# EAGLE design alpha3 (EAGLE 7.6.0)

## Sheet 1 of 5
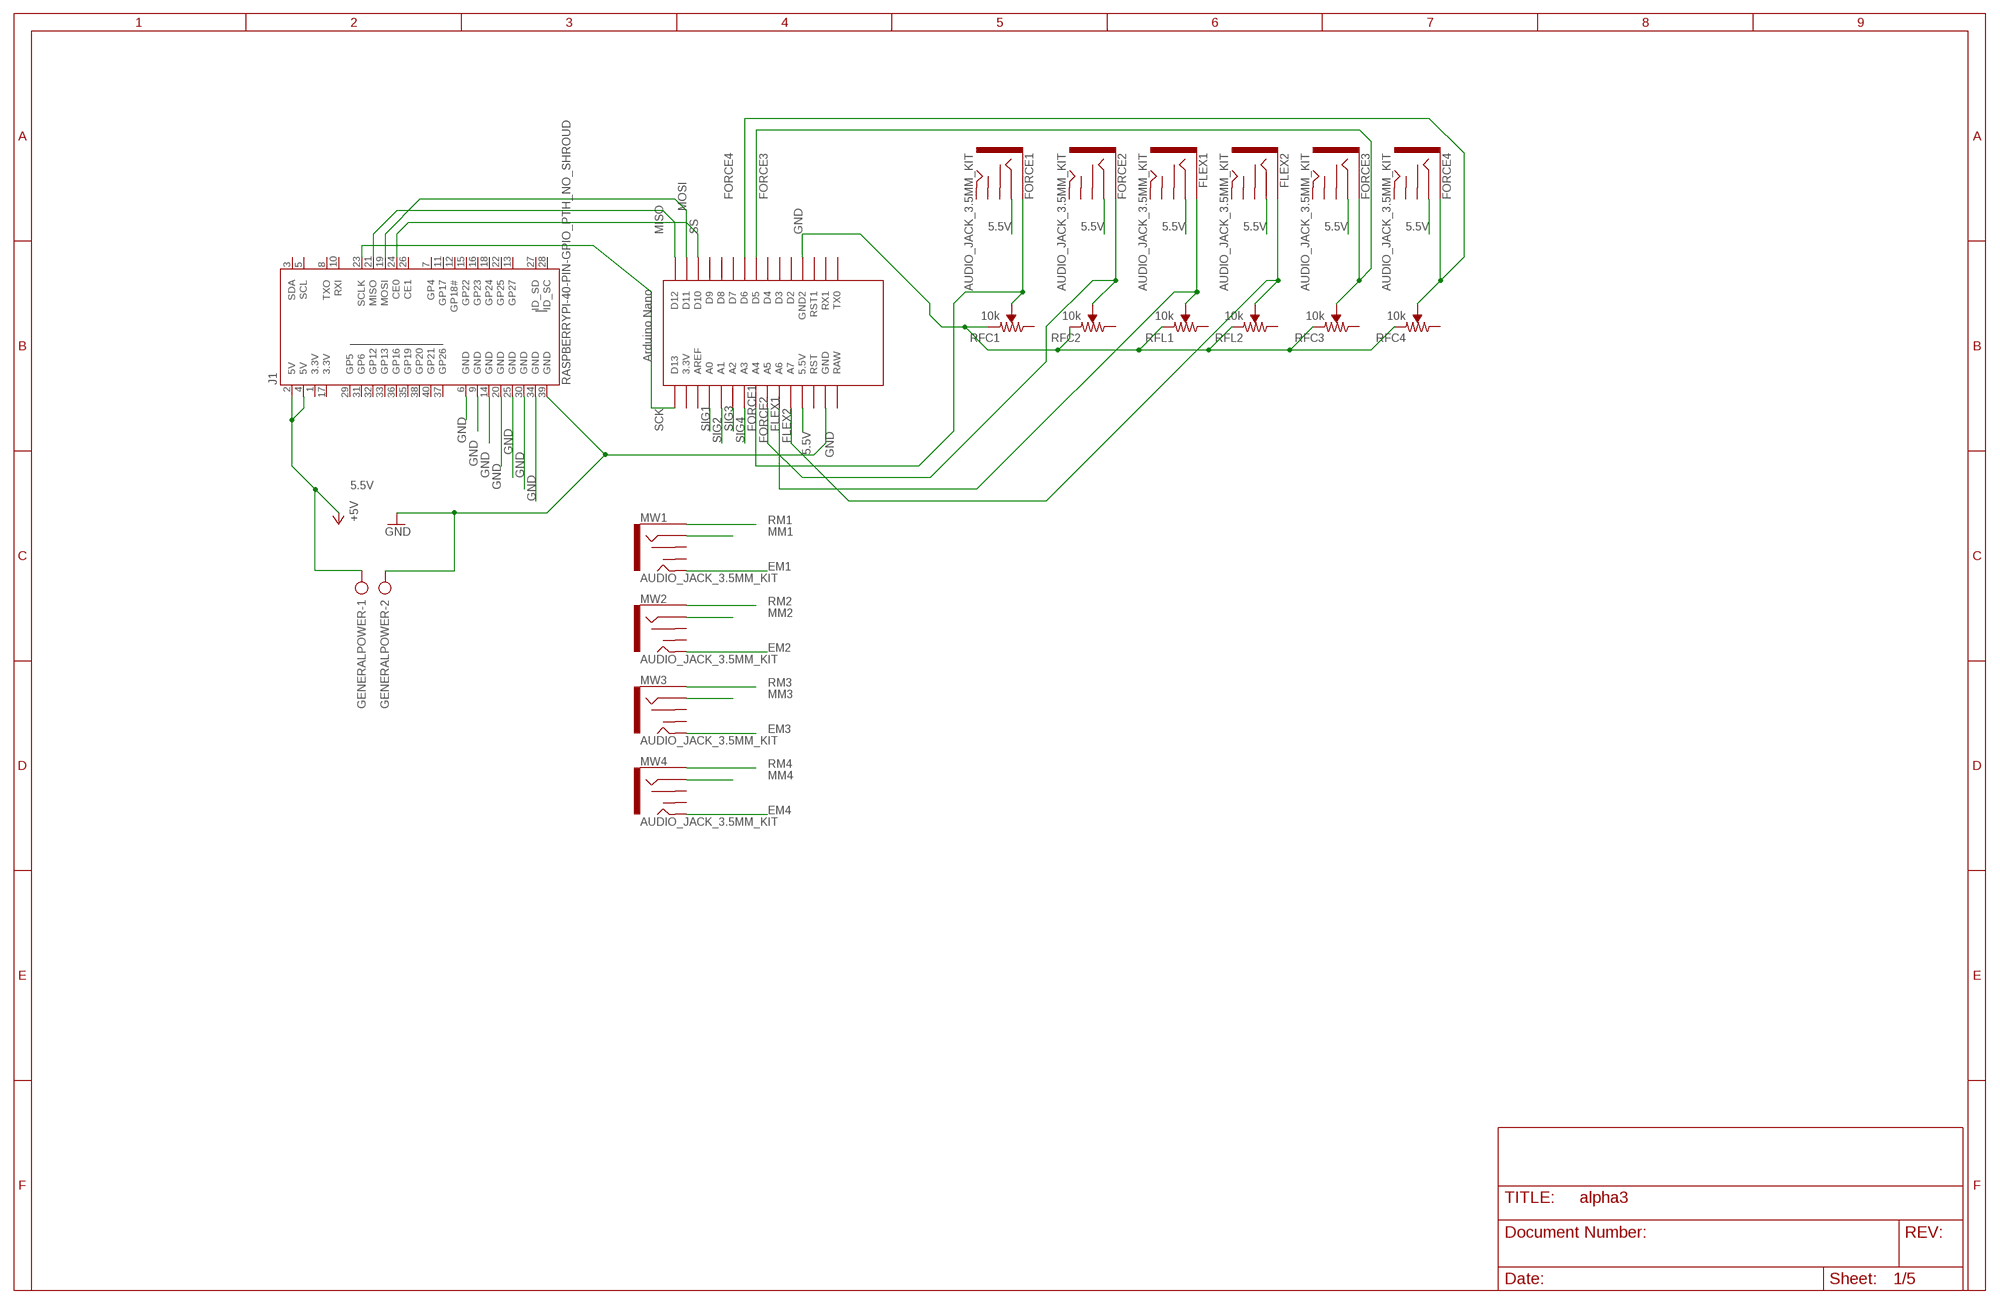
[diagram p0: schematic, sheet 1]

### Parts
FLEX1  AUDIO_JACK_3.5MM_KIT  [AUDIO-JACK-KIT]
FLEX2  AUDIO_JACK_3.5MM_KIT  [AUDIO-JACK-KIT]
FORCE1  AUDIO_JACK_3.5MM_KIT  [AUDIO-JACK-KIT]
FORCE2  AUDIO_JACK_3.5MM_KIT  [AUDIO-JACK-KIT]
FORCE3  AUDIO_JACK_3.5MM_KIT  [AUDIO-JACK-KIT]
FORCE4  AUDIO_JACK_3.5MM_KIT  [AUDIO-JACK-KIT]
GENERALPOWER  AK500/2  [AK500/2]
J1  RASPBERRYPI-40-PIN-GPIO_PTH_NO_SHROUD  [2X20]
MW1  AUDIO_JACK_3.5MM_KIT  [AUDIO-JACK-KIT]
MW2  AUDIO_JACK_3.5MM_KIT  [AUDIO-JACK-KIT]
MW3  AUDIO_JACK_3.5MM_KIT  [AUDIO-JACK-KIT]
MW4  AUDIO_JACK_3.5MM_KIT  [AUDIO-JACK-KIT]
RFC1  10k  TRIMPOT-PTH-10MM-KNOB-1/2W-10%  [TRIMPOT-PTH-3386U]
RFC2  10k  TRIMPOT-PTH-10MM-KNOB-1/2W-10%  [TRIMPOT-PTH-3386U]
RFC3  10k  TRIMPOT-PTH-10MM-KNOB-1/2W-10%  [TRIMPOT-PTH-3386U]
RFC4  10k  TRIMPOT-PTH-10MM-KNOB-1/2W-10%  [TRIMPOT-PTH-3386U]
RFL1  10k  TRIMPOT-PTH-10MM-KNOB-1/2W-10%  [TRIMPOT-PTH-3386U]
RFL2  10k  TRIMPOT-PTH-10MM-KNOB-1/2W-10%  [TRIMPOT-PTH-3386U]
U$1  NANO  [NANO]

### Nets
5.5V: FLEX1.RING FLEX2.RING FORCE1.RING FORCE2.RING FORCE3.RING FORCE4.RING GENERALPOWER.1 J1.2(5V) J1.4(5V) U$1.5V(5.5V) ; supply symbol labelled +5V ; also sheet 2,3,4,5
EM1: MW1.TIP ; also sheet 2
EM2: MW2.TIP ; also sheet 3
EM3: MW3.TIP ; also sheet 4
EM4: MW4.TIP ; also sheet 5
FLEX1: FLEX1.SLEEVE RFL1.2(WIPER) U$1.A6
FLEX2: FLEX2.SLEEVE RFL2.2(WIPER) U$1.A7
FORCE1: FORCE1.SLEEVE RFC1.2(WIPER) U$1.A4
FORCE2: FORCE2.SLEEVE RFC2.2(WIPER) U$1.A5
FORCE3: FORCE3.SLEEVE RFC3.2(WIPER) U$1.D5
FORCE4: FORCE4.SLEEVE RFC4.2(WIPER) U$1.D6
GND: GENERALPOWER.2 J1.6(GND) J1.9(GND) J1.14(GND) J1.20(GND) J1.25(GND) J1.30(GND) J1.34(GND) J1.39(GND) RFC1.1(CCW) RFC2.1(CCW) RFC3.1(CCW) RFC4.1(CCW) RFL1.1(CCW) RFL2.1(CCW) U$1.GND U$1.GND1(GND2) ; also sheet 2,3,4,5
MISO: J1.21(MISO) U$1.D12
MM1: MW1.RING ; also sheet 2
MM2: MW2.RING ; also sheet 3
MM3: MW3.RING ; also sheet 4
MM4: MW4.RING ; also sheet 5
MOSI: J1.19(MOSI) U$1.D11
RM1: MW1.SLEEVE ; also sheet 2
RM2: MW2.SLEEVE ; also sheet 3
RM3: MW3.SLEEVE ; also sheet 4
RM4: MW4.SLEEVE ; also sheet 5
SCK: J1.23(SCLK) U$1.D13
SIG1: U$1.A0 ; also sheet 2
SIG2: U$1.A1 ; also sheet 3
SIG3: U$1.A2 ; also sheet 4
SIG4: U$1.A3 ; also sheet 5
SS: J1.24(CE0) U$1.D10
Unconnected: FLEX1.RSH FLEX1.TIP FLEX1.TSH FLEX2.RSH FLEX2.TIP FLEX2.TSH FORCE1.RSH FORCE1.TIP FORCE1.TSH FORCE2.RSH FORCE2.TIP FORCE2.TSH FORCE3.RSH FORCE3.TIP FORCE3.TSH FORCE4.RSH FORCE4.TIP FORCE4.TSH J1.3(SDA) J1.5(SCL) J1.7(GP4) J1.8(TXO) J1.10(RXI) J1.11(GP17) J1.12(GP18#) J1.13(GP27) J1.15(GP22) J1.16(GP23) J1.18(GP24) J1.22(GP25) J1.26(CE1) J1.27(ID_SD) J1.28(ID_SC) J1.29(GP5) J1.31(GP6) J1.32(GP12) J1.33(GP13) J1.35(GP19) J1.36(GP16) J1.37(GP26) J1.38(GP20) J1.40(GP21) MW1.RSH MW1.TSH MW2.RSH MW2.TSH MW3.RSH MW3.TSH MW4.RSH MW4.TSH RFC1.3(CW) RFC2.3(CW) RFC3.3(CW) RFC4.3(CW) RFL1.3(CW) RFL2.3(CW) U$1.3.3V U$1.AREF U$1.D2 U$1.D3 U$1.D4 U$1.D7 U$1.D8 U$1.D9 U$1.ICSP1 U$1.ICSP2 U$1.ICSP3 U$1.ICSP4 U$1.ICSP5 U$1.ICSP6 U$1.RAW U$1.RST U$1.RST1 U$1.RX1 U$1.TX0

## Sheet 2 of 5
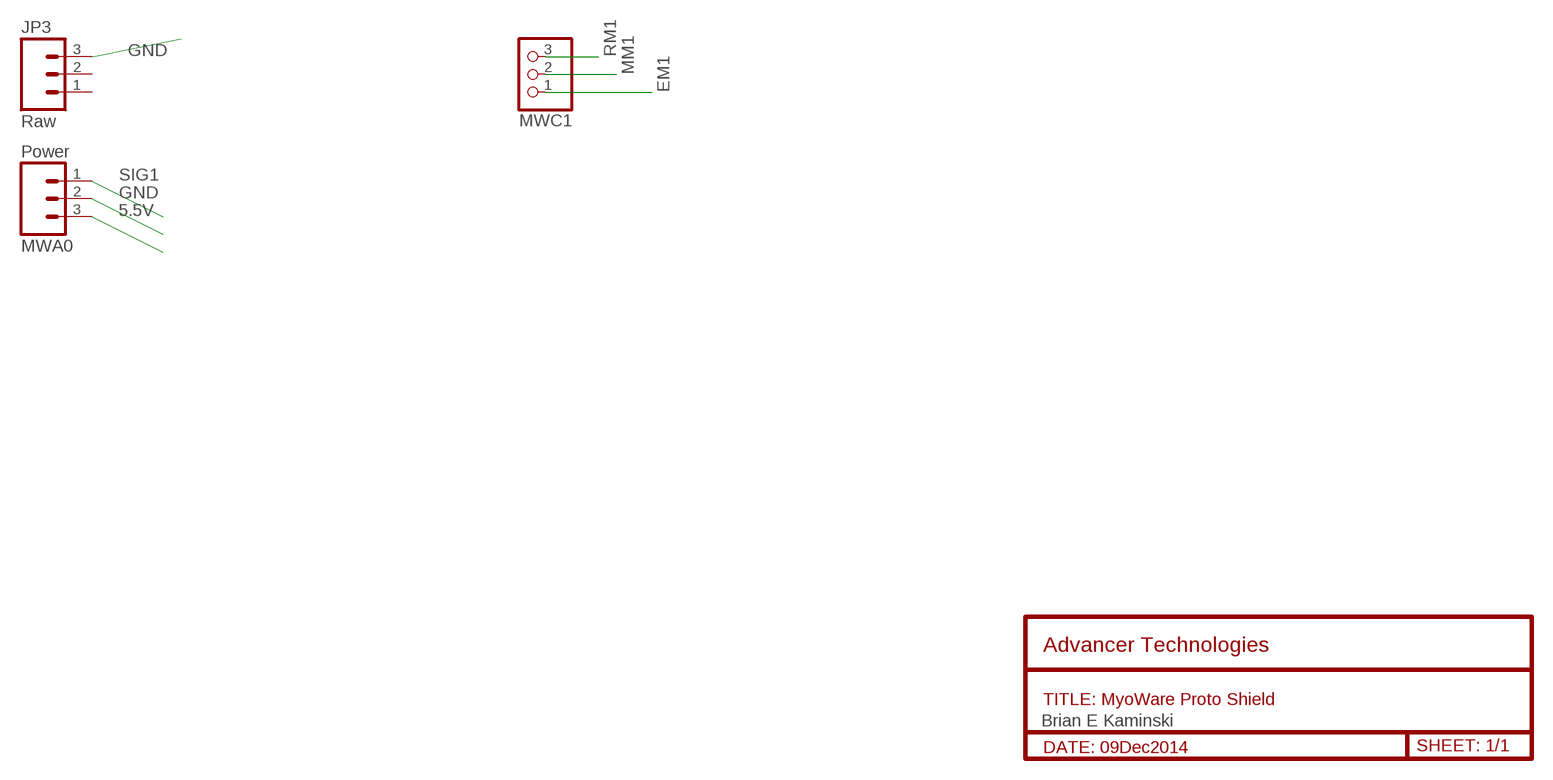
[diagram p1: schematic, sheet 2]

### Parts
JP3  Raw  M031X03_NO_SILK  [1X03_NO_SILK]
MWA0  Power  M031X03_NO_SILK  [1X03_NO_SILK]
MWC1  PINHD-1X3  [1X03]

### Nets
5.5V: MWA0.3 ; also sheet 1,3,4,5
EM1: MWC1.1 ; also sheet 1
GND: JP3.3 MWA0.2 ; also sheet 1,3,4,5
MM1: MWC1.2 ; also sheet 1
RM1: MWC1.3 ; also sheet 1
SIG1: MWA0.1 ; also sheet 1
Unconnected: JP3.1 JP3.2

### Notes on the sheet
- Advancer Technologies
- TITLE: MyoWare Proto Shield
- Brian E Kaminski
- DATE: 09Dec2014 | SHEET: 1/1

## Sheet 3 of 5
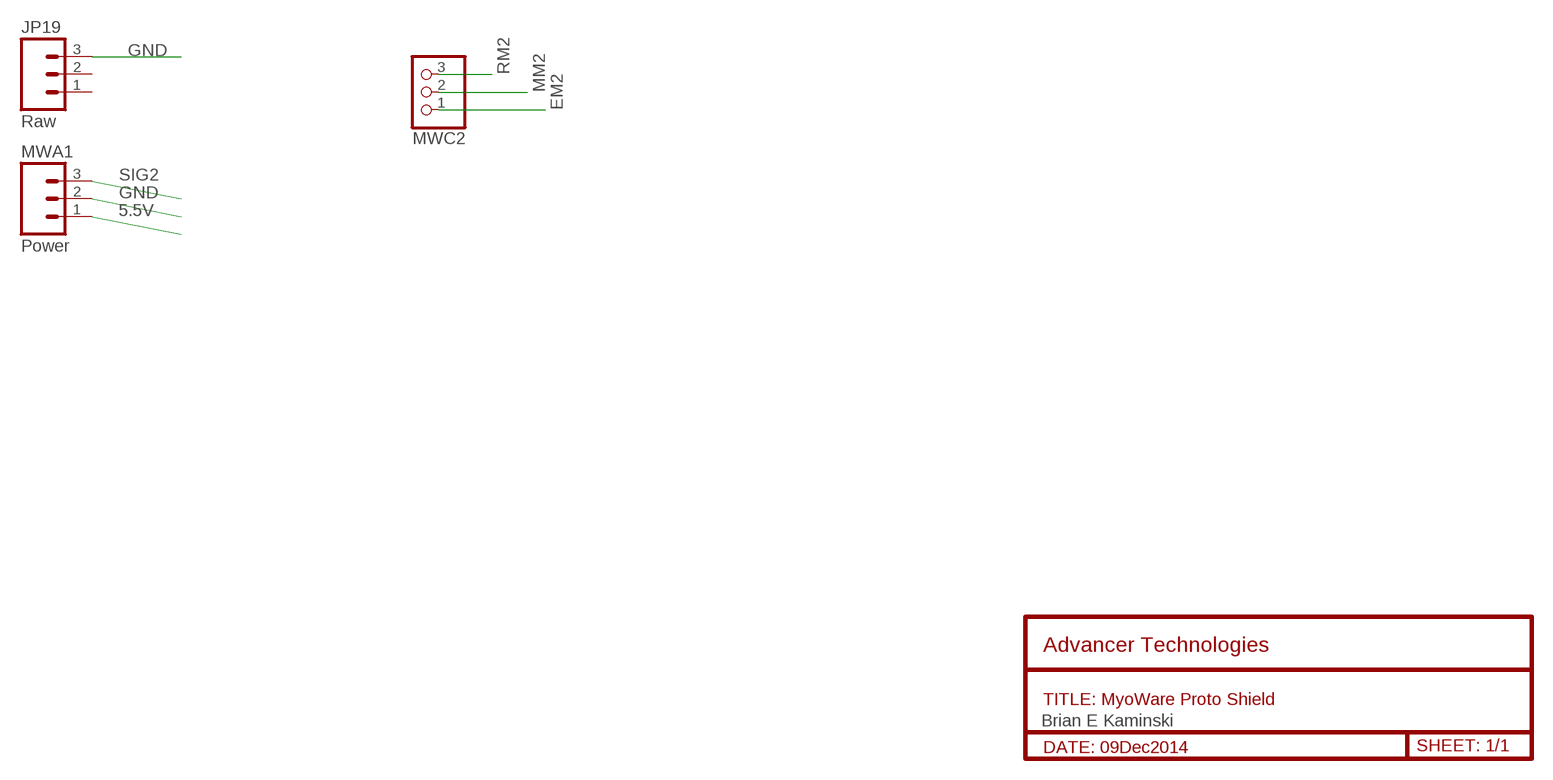
[diagram p2: schematic, sheet 3]

### Parts
JP19  Raw  M031X03_NO_SILK  [1X03_NO_SILK]
MWA1  Power  M031X03_NO_SILK  [1X03_NO_SILK]
MWC2  PINHD-1X3  [1X03]

### Nets
5.5V: MWA1.1 ; also sheet 1,2,4,5
EM2: MWC2.1 ; also sheet 1
GND: JP19.3 MWA1.2 ; also sheet 1,2,4,5
MM2: MWC2.2 ; also sheet 1
RM2: MWC2.3 ; also sheet 1
SIG2: MWA1.3 ; also sheet 1
Unconnected: JP19.1 JP19.2

### Notes on the sheet
- Advancer Technologies
- TITLE: MyoWare Proto Shield
- Brian E Kaminski
- DATE: 09Dec2014 | SHEET: 1/1

## Sheet 4 of 5
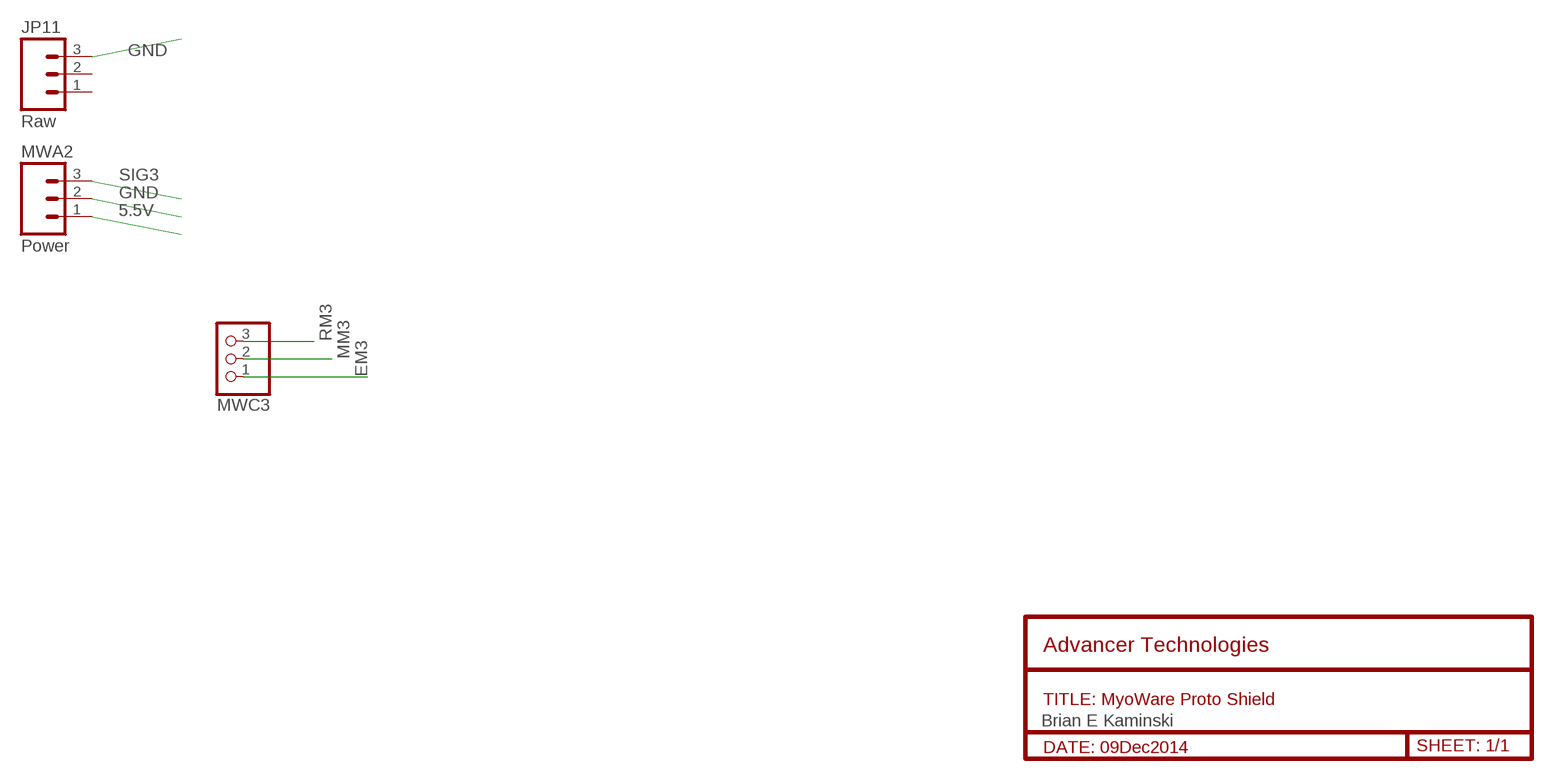
[diagram p3: schematic, sheet 4]

### Parts
JP11  Raw  M031X03_NO_SILK  [1X03_NO_SILK]
MWA2  Power  M031X03_NO_SILK  [1X03_NO_SILK]
MWC3  PINHD-1X3  [1X03]

### Nets
5.5V: MWA2.1 ; also sheet 1,2,3,5
EM3: MWC3.1 ; also sheet 1
GND: JP11.3 MWA2.2 ; also sheet 1,2,3,5
MM3: MWC3.2 ; also sheet 1
RM3: MWC3.3 ; also sheet 1
SIG3: MWA2.3 ; also sheet 1
Unconnected: JP11.1 JP11.2

### Notes on the sheet
- Advancer Technologies
- TITLE: MyoWare Proto Shield
- Brian E Kaminski
- DATE: 09Dec2014 | SHEET: 1/1

## Sheet 5 of 5
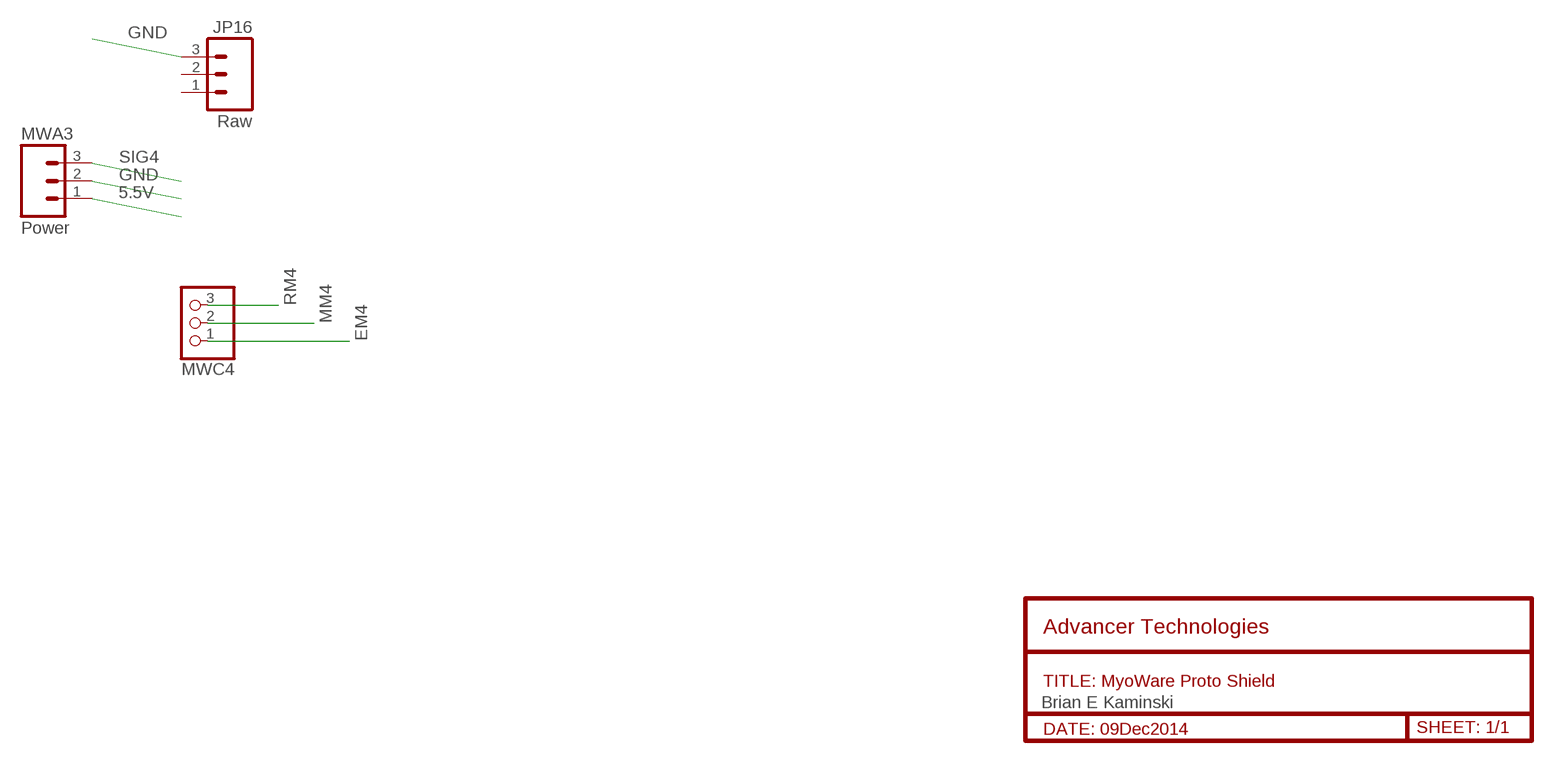
[diagram p4: schematic, sheet 5]

### Parts
JP16  Raw  M031X03_NO_SILK  [1X03_NO_SILK]
MWA3  Power  M031X03_NO_SILK  [1X03_NO_SILK]
MWC4  PINHD-1X3  [1X03]

### Nets
5.5V: MWA3.1 ; also sheet 1,2,3,4
EM4: MWC4.1 ; also sheet 1
GND: JP16.3 MWA3.2 ; also sheet 1,2,3,4
MM4: MWC4.2 ; also sheet 1
RM4: MWC4.3 ; also sheet 1
SIG4: MWA3.3 ; also sheet 1
Unconnected: JP16.1 JP16.2

### Notes on the sheet
- Advancer Technologies
- TITLE: MyoWare Proto Shield
- Brian E Kaminski
- DATE: 09Dec2014 | SHEET: 1/1

## Power pins joined to a net without a drawn wire
3.3V: J1.1(3.3V) J1.17(3.3V)

## Library data of the parts
FLEX1 FLEX2 FORCE1-FORCE4 MW1-MW4 = SparkFun-Connectors:AUDIO_JACK_3.5MM: Audio Jack 3.5mm variants of PTH and SMT stereo audio jack with bypass switches. SparkFun Products: SparkFun SparkPunk Sound Kit <[https://www.sparkfun.com/products/11177]> - PTH MP3 Trigger <https://www.sparkfun.com/products/13720> -3.5mm SMD SparkFun PicoBoard <https://www.sparkfun.com/products/11888>- 2.5mm SMD; PROD_ID: CONN-08774; SF_ID: PRT-08032
GENERALPOWER = con-ptr500:AK500/2: CONNECTOR; OC_FARNELL: unknown; OC_NEWARK: unknown
J1 = SparkFun-Connectors:RASPBERRYPI-40-PIN-GPIO: Raspberry Pi GPIO Header 2x20 pin connector, as found on B, B+, A+ models. Both shrouded PTH and SMT versions available. SparkFun Products: GPIO Shrouded Header <https://www.sparkfun.com/products/13054>- PTH SparkFun Pi Wedge (Preassembled) <https://www.sparkfun.com/products/13717>
JP3 JP11 JP16 JP19 MWA0 MWA1-MWA3 = SparkFun-Connectors:M03: Header 3 Standard 3-pin 0.1" header. Use with straight break away headers (SKU : PRT-00116), right angle break away headers (PRT-00553), swiss pins (PRT-00743), machine pins (PRT-00117), and female headers (PRT-00115). Molex polarized connector foot print use with SKU : PRT-08232 with associated crimp pins and housings.
MWC1-MWC4 = pinhead:PINHD-1X3: PIN HEADER
RFC1-RFC4 RFL1 RFL2 = SparkFun-Resistors:TRIMPOT: Trimming Potentiometer (Trimpot) Three-terminal potentiometers, with an adjustable wiper and two adjustable resistors. A pot can be used to create a configurable voltage divider, or as a variable resistor. "Trimpots" are a subset of potentiometers, usually intended for "set-and-forget" applications. They're often more delicate than standard potentiometers - rated for fewer turns. Variants PTH-KNOB - PTH Trimpot w/ finger-adjustable knob Trimpot 10K with Knob <https://www.sparkfun.com/products/9806> (COM-09806) Datasheet <http://www.sparkfun.com/datasheets/Components/General/TSR-3386.pdf> SMD-3MM-CLOSED-FRAME - SMD 3mm Square Closed-Frame Trimpot Used on e.g. EasyDriver - Stepper Motor Driver <https://www.sparkfun.com/products/12779> Datasheet <http://www.bitechnologies.com/pdfs/22.pdf> (22AR10KTR) SMD-5MM - SMD 5mm Square Closed-Frame Trimpot Used on e.g. IOIO-OTG - V2.2 <https://www.sparkfun.com/products/13613> Datasheet <http://www.vishay.com/docs/51008/ts53.pdf> (TS53YL502MR10) SMD-3MM-1/10W-25% - 3mm Square Open-Frame Trimpot Used on e.g. SparkFun Shapeoko <https://www.sparkfun.com/products/13899> Datasheet <http://www.bourns.com/docs/Product-Datasheets/TC33.pdf> (TC33X-2-103E); PROD_ID: RES-09730; SF_SKU: COM-09806
U$1 = Arduino-clone:NANO: Arduino Nano

## Board
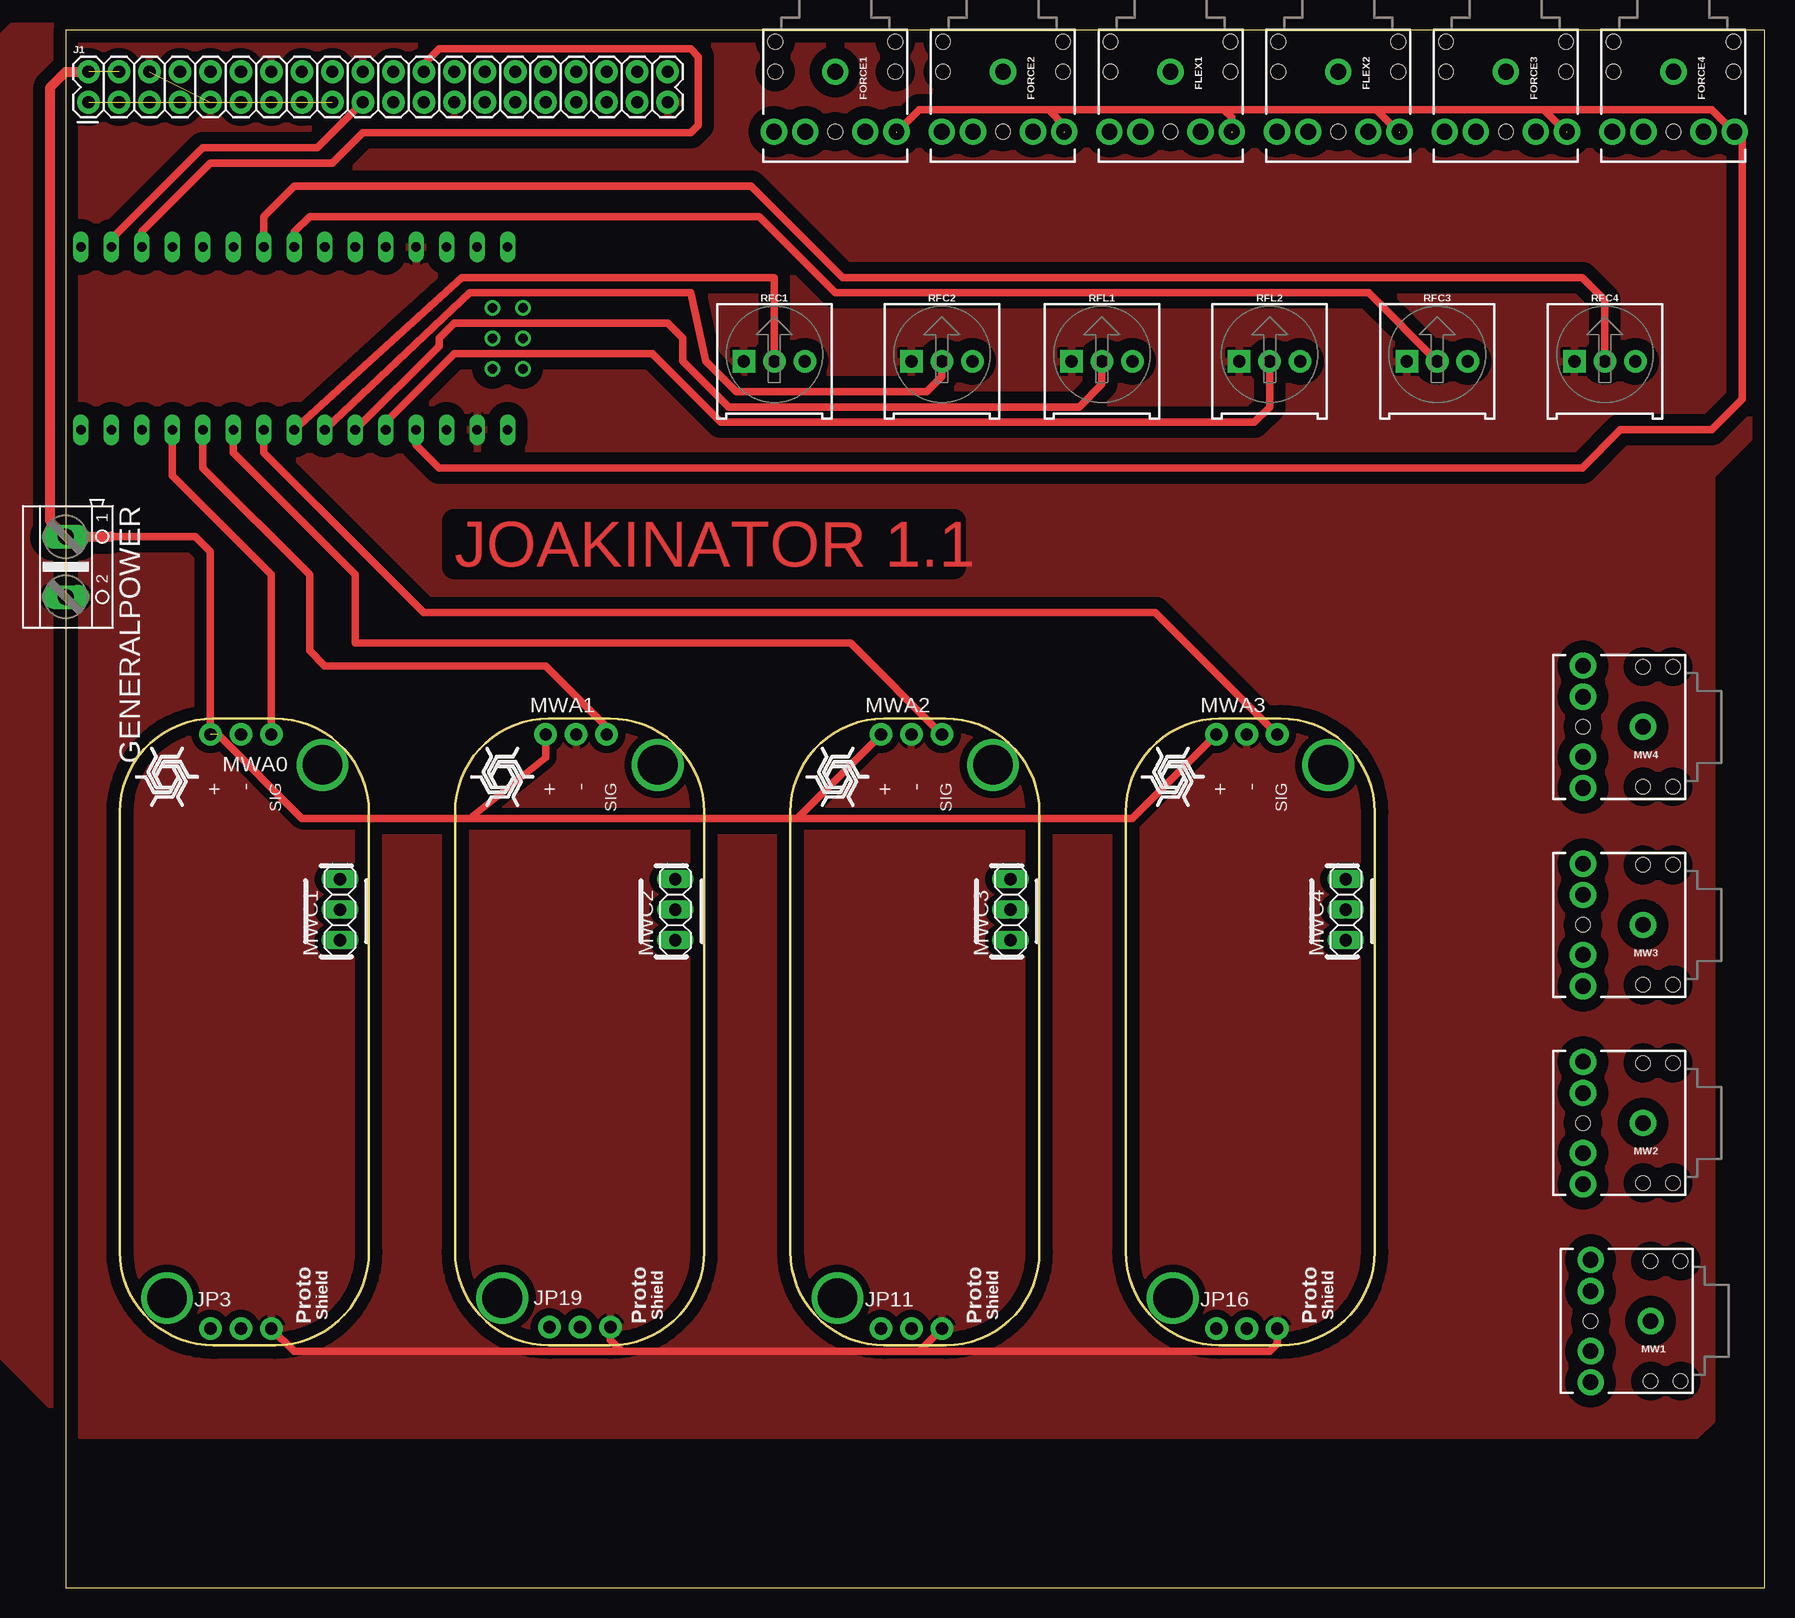
[diagram p5: board, top side]
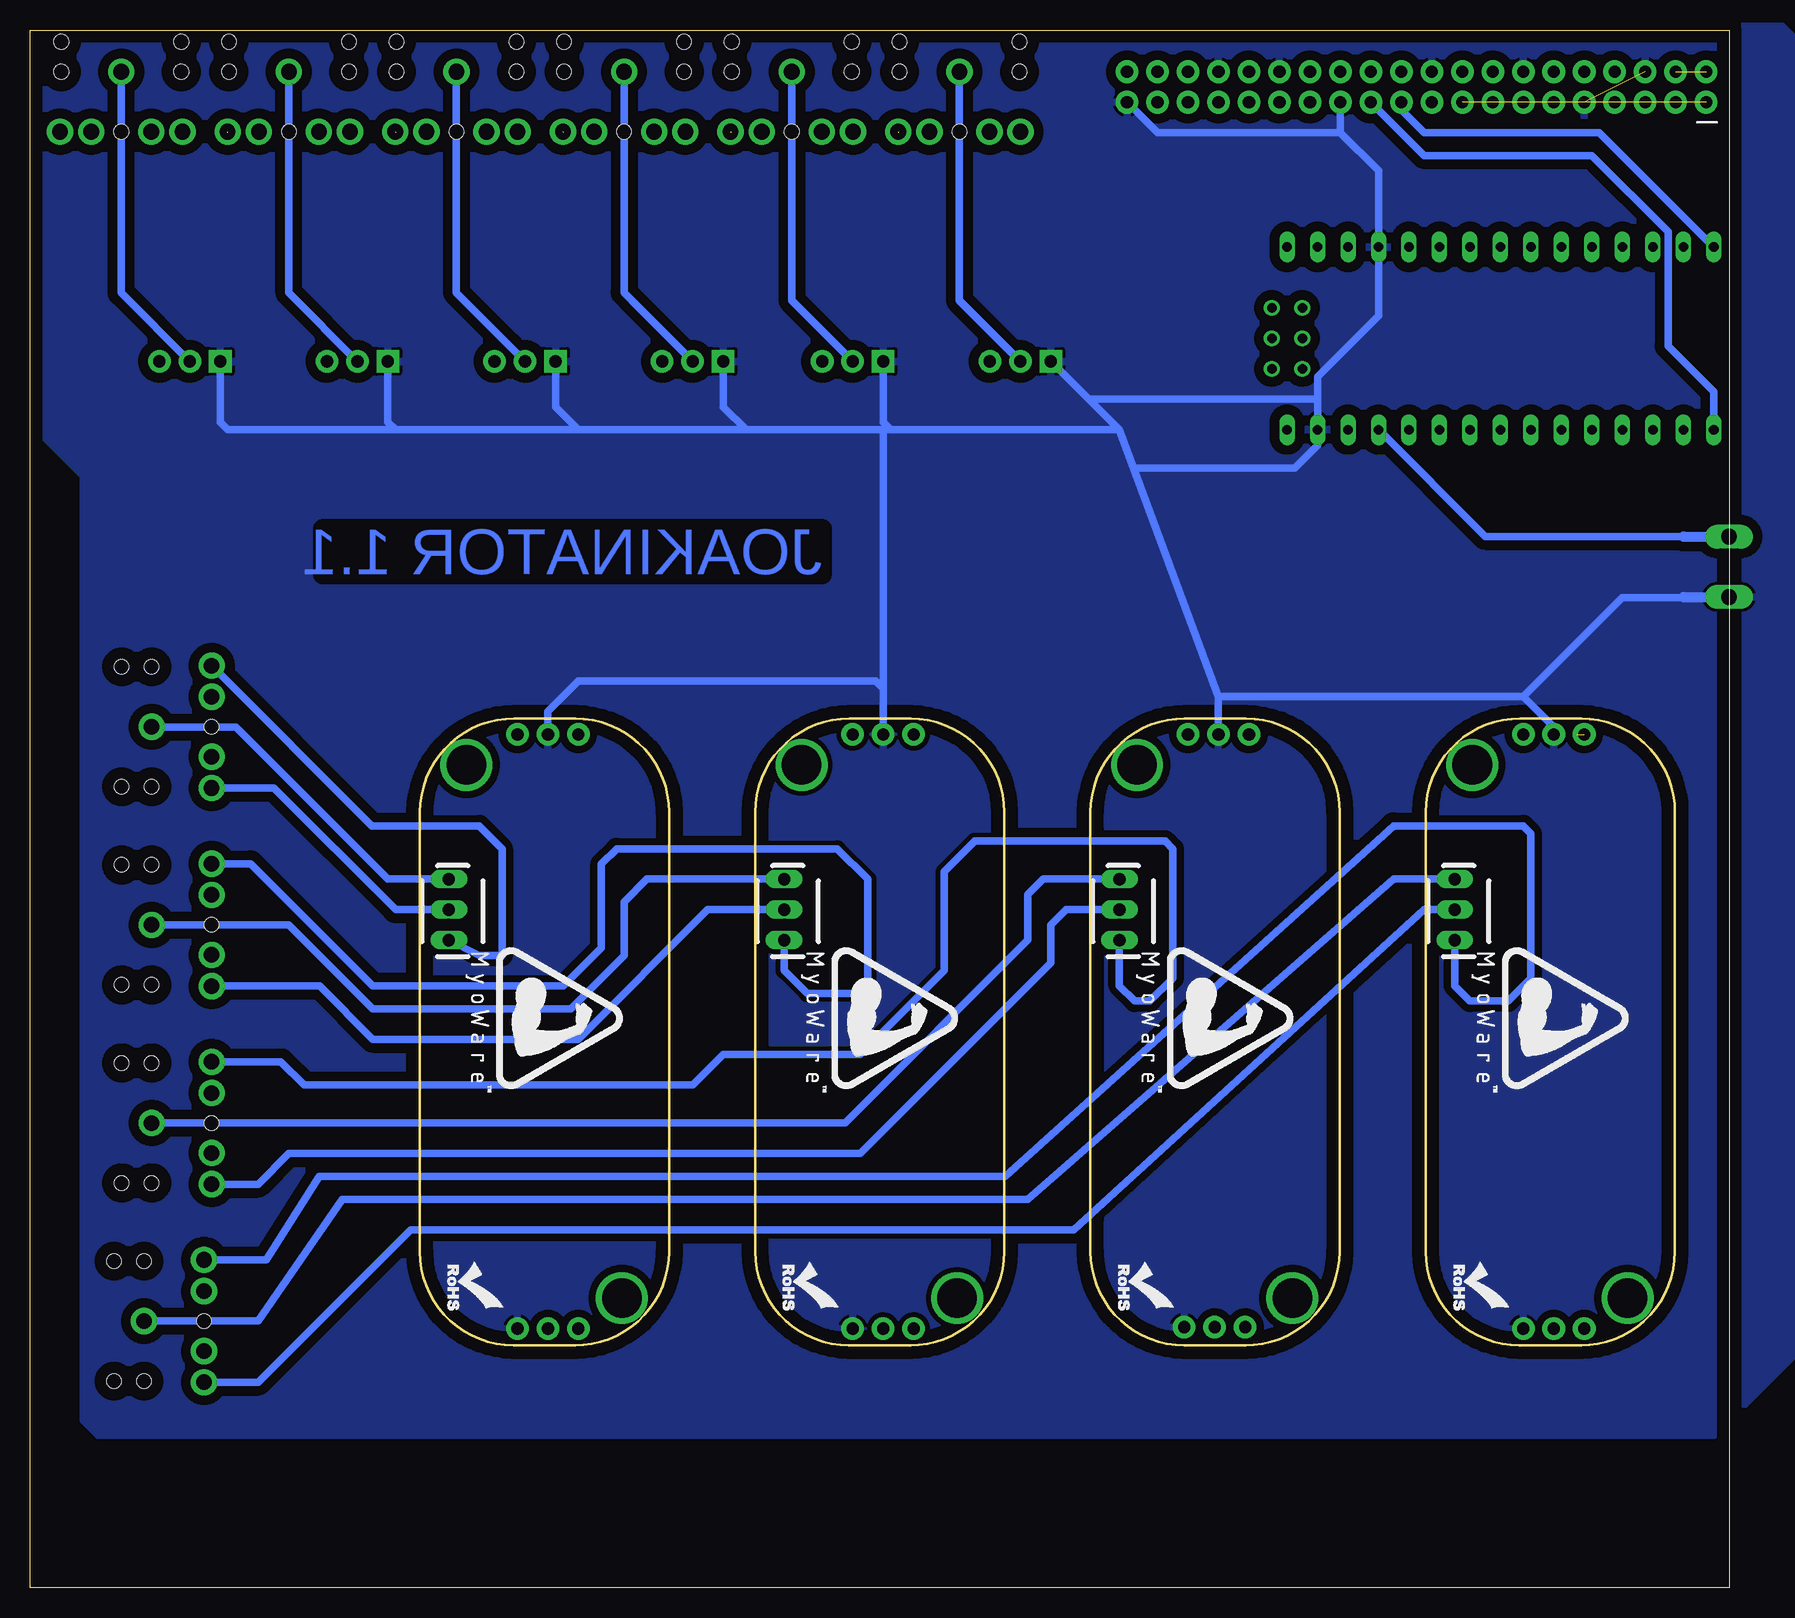
[diagram p6: board, bottom side, seen from below]

Size 141.59 x 129.84 mm. Coordinates in mm from the lower left corner, seen from the top.
Outline: 25.27,27.97 25.27,64.64 arc90 17.4,72.45 12.32,72.45 arc90 4.51,64.64 4.51,28
Outline: 4.51,28 4.51,27.97
Outline: 12.38,20.19 17.46,20.19 arc90 25.27,28
Outline: 12.38,20.19 12.32,20.19
Outline: 4.51,28 arc90 12.38,20.19
Outline: 53.21,27.97 53.21,64.64 arc90 45.34,72.45 40.26,72.45 arc90 32.45,64.64 32.45,28
Outline: 32.45,28 32.45,27.97
Outline: 40.32,20.19 45.4,20.19 arc90 53.21,28
Outline: 40.32,20.19 40.26,20.19
Outline: 32.45,28 arc90 40.32,20.19
Outline: 81.15,27.97 81.15,64.64 arc90 73.28,72.45 68.2,72.45 arc90 60.39,64.64 60.39,28
Outline: 60.39,28 60.39,27.97
Outline: 68.26,20.19 73.34,20.19 arc90 81.15,28
Outline: 68.26,20.19 68.2,20.19
Outline: 60.39,28 arc90 68.26,20.19
Outline: 109.09,27.97 109.09,64.64 arc90 101.22,72.45 96.14,72.45 arc90 88.33,64.64 88.33,28
Outline: 88.33,28 88.33,27.97
Outline: 96.2,20.19 101.28,20.19 arc90 109.09,28
Outline: 96.2,20.19 96.14,20.19
Outline: 88.33,28 arc90 96.2,20.19
Outline: 0,0 141.59,0 141.59,129.84 0,129.84 0,0
Copper layers (1*16): Top 0.035mm / dielectric 1.5mm / Bottom 0.035mm
Design rules "default": minimum track width 10mil, minimum drill 24mil, track to track 8mil, track to pad 8mil, pad to pad 8mil, via to via 8mil, smd to smd 8mil, copper to edge 40mil, drill to drill 8mil, minimum pad ring 10mil, minimum via ring 8mil, stop-mask expansion 4mil, vias tented up to drill 0mil, thermal gap 10mil

### Footprints (pad centres in the part's own frame; a part is rotated, then mirrored left to right if it is on the bottom)
AUDIO-JACK-KIT = drill 1.3 pad 2.184: RING 5,5.1; RSH 5,2.5; SLEEVE 0,0; TIP 5,-5.1; TSH 5,-2.5 | hole 1.2: 0,5; -2.5,5; -2.5,-5; 0,-5; 5,0
AK500/2 = drill 1.321 long: 1 -2.515,0; 2 2.515,0
2X20 = drill 1.016 pad 1.88: 1 0,0; 2 0,2.54; 3 2.54,0; 4 2.54,2.54; 5 5.08,0; 6 5.08,2.54; 7 7.62,0; 8 7.62,2.54; 9 10.16,0; 10 10.16,2.54; 11 12.7,0; 12 12.7,2.54; 13 15.24,0; 14 15.24,2.54; 15 17.78,0; 16 17.78,2.54; 17 20.32,0; 18 20.32,2.54; 19 22.86,0; 20 22.86,2.54; 21 25.4,0; 22 25.4,2.54; 23 27.94,0; 24 27.94,2.54; 25 30.48,0; 26 30.48,2.54; 27 33.02,0; 28 33.02,2.54; 29 35.56,0; 30 35.56,2.54; 31 38.1,0; 32 38.1,2.54; 33 40.64,0; 34 40.64,2.54; 35 43.18,0; 36 43.18,2.54; 37 45.72,0; 38 45.72,2.54; 39 48.26,0; 40 48.26,2.54
1X03_NO_SILK = drill 1.016 pad 1.88: 1 0,0; 2 2.54,0; 3 5.08,0
1X03 = drill 1.016 long: 1 -2.54,0; 2 0,0; 3 2.54,0
TRIMPOT-PTH-3386U = drill 1.016 pad 1.88 square: 1 -2.54,-0.015 | drill 1.016 pad 1.88: 2 0,-0.015; 3 2.54,-0.015
NANO = drill 0.8 long: 3.3V -10.16,24.13; 5V -10.16,-1.27; A0 -10.16,19.05; A1 -10.16,16.51; A2 -10.16,13.97; A3 -10.16,11.43; A4 -10.16,8.89; A5 -10.16,6.35; A6 -10.16,3.81; A7 -10.16,1.27; AREF -10.16,21.59; D2 5.08,1.27; D3 5.08,3.81; D4 5.08,6.35; D5 5.08,8.89; D6 5.08,11.43; D7 5.08,13.97; D8 5.08,16.51; D9 5.08,19.05; D10 5.08,21.59; D11 5.08,24.13; D12 5.08,26.67; D13 -10.16,26.67; GND -10.16,-6.35; GND1 5.08,-1.27; RAW -10.16,-8.89; RST -10.16,-3.81; RST1 5.08,-3.81; RX1 5.08,-6.35; TX0 5.08,-8.89 | drill 0.8: ICSP1 -5.08,-10.16; ICSP2 -5.08,-7.62; ICSP3 -2.54,-10.16; ICSP4 -2.54,-7.62; ICSP5 0,-10.16; ICSP6 0,-7.62

### Placement (x,y rotation side)
FLEX1  92.08,126.36 270 top
FLEX2  106.05,126.36 270 top
FORCE1  64.14,126.36 270 top
FORCE2  78.1,126.36 270 top
FORCE3  120.02,126.36 270 top
FORCE4  133.99,126.36 270 top
GENERALPOWER  0,85.09 270 top
J1  1.9,123.83 0 top
JP3  12.06,21.59 0 top
JP11  67.94,21.59 0 top
JP16  95.88,21.59 0 top
JP19  40.32,21.72 0 top
MW1  132.08,22.22 180 top
MW2  131.44,38.73 180 top
MW3  131.44,55.24 180 top
MW4  131.44,71.75 180 top
MWA0  17.14,71.12 180 top
MWA1  40,71.12 0 top
MWA2  67.94,71.12 0 top
MWA3  95.88,71.12 0 top
MWC1  22.86,56.52 90 top
MWC2  50.8,56.52 90 top
MWC3  78.74,56.52 90 top
MWC4  106.68,56.52 90 top
RFC1  59.06,102.23 0 top
RFC2  73.03,102.23 0 top
RFC3  114.3,102.23 0 top
RFC4  128.27,102.23 0 top
RFL1  86.36,102.23 0 top
RFL2  100.33,102.23 0 top
U$1  27.94,106.68 90 top
U$2  [MYOWARE_LOGO]  14.92,47.5 270 bottom
U$3  [ROHS]  22.99,27.18 270 bottom
U$6  [ROHS]  50.93,27.18 270 bottom
U$7  [SPIRAL_LOGO_60%]  36.39,67.63 90 top
U$8  [MYOWARE_LOGO]  42.86,47.5 270 bottom
U$9  [SPIRAL_LOGO_60%]  8.45,67.63 90 top
U$11  [ROHS]  78.87,27.18 270 bottom
U$12  [SPIRAL_LOGO_60%]  64.33,67.63 90 top
U$13  [MYOWARE_LOGO]  70.8,47.5 270 bottom
U$15  [ROHS]  106.81,27.18 270 bottom
U$16  [SPIRAL_LOGO_60%]  92.27,67.63 90 top
U$17  [MYOWARE_LOGO]  98.74,47.5 270 bottom

### Tracks (layer width: path | path; a pad name or v marks a point on that pad's centre or on a via)
3.3V  (1 unrouted)
5.5V  (7 unrouted)
  Top 0.61: 3.81,87.63 10.79,87.63 12.06,86.36 MWA0.3 | 12.7,71.12 19.69,64.13 33.66,64.13 | 33.66,64.13 40,69.22 MWA1.1 | 33.66,64.13 60.96,64.13 | 60.96,64.13 MWA2.1 | 60.96,64.13 88.9,64.13 MWA3.1 | 81.91,123.19 71.12,123.19 69.22,121.28 | 81.91,123.19 83.19,121.92 83.19,121.28 | 81.91,123.19 96.52,123.19 | 96.52,123.19 97.16,122.55 97.16,121.28 | 96.52,123.19 109.22,123.19 | 109.22,123.19 111.12,121.28 | 109.22,123.19 123.19,123.19 | 123.19,123.19 125.09,121.28 | 123.19,123.19 137.16,123.19 139.7,120.65 | 139.7,120.65 139.7,99.06 137.16,96.52 129.54,96.52 126.36,93.34 31.11,93.34 29.21,95.25 U$1.5V | 139.7,120.65 139.7,120.75 FORCE4.RING
  Top 0.813: J1.2 0,126.36 -1.27,125.09 -1.27,88.88 GENERALPOWER.1 0.03,87.63 3.81,87.63
  Bottom 0.61: U$1.5V 20.32,87.63 3.81,87.63
  Bottom 0.813: 3.81,87.63 3.79,87.6 GENERALPOWER.1
EM1
  Bottom 0.61: MW1.TIP 121.9,27.32 117.47,34.29 60.33,34.29 27.94,63.5 17.14,63.5 16.51,62.87 16.51,50.8 18.41,48.89 21.59,48.89 22.86,50.16 MWC1.1
EM2
  Bottom 0.61: MW2.TIP 120.67,43.84 118.74,41.91 86.36,41.91 83.82,44.45 72.39,44.45 65.41,51.44 65.41,59.69 62.86,62.23 46.99,62.23 46.36,61.59 46.36,50.8 48.26,48.89 49.53,48.89 50.8,50.16 MWC2.1
EM3
  Bottom 0.61: MW3.TIP 123.21,60.34 113.03,50.16 97.16,50.16 93.98,53.34 93.98,60.33 92.71,61.59 74.3,61.59 71.75,59.05 71.75,49.53 76.83,49.53 78.74,51.44 MWC3.1
EM4
  Bottom 0.61: MW4.TIP 113.09,63.5 104.14,63.5 102.23,61.59 102.23,52.7 104.14,52.7 MWC4.1
FLEX1
  Top 0.61: RFL1.2 86.36,100.33 84.45,98.42 55.25,98.42 51.44,102.23 51.44,104.14 50.17,105.41 32.39,105.41 31.11,104.14 31.11,103.5 U$1.A6
  Bottom 0.61: RFL1.2 91.44,107.31 | FLEX1.SLEEVE 92.08,107.95 91.44,107.31 | 91.44,107.31 91.44,107.3 RFL1.2
FLEX2
  Top 0.61: RFL2.2 100.33,98.42 99.06,97.16 54.61,97.16 48.89,102.87 32.39,102.87 26.67,97.16 U$1.A7
  Bottom 0.61: FLEX2.SLEEVE 106.05,107.95 101.6,103.5 100.34,102.23 RFL2.2
FORCE1
  Top 0.61: RFC1.2 59.06,109.22 33.02,109.22 U$1.A4
  Bottom 0.61: RFC1.2 64.14,107.31 | FORCE1.SLEEVE 64.14,107.31 | 64.14,107.31 64.14,107.3 RFC1.2
FORCE2
  Top 0.61: RFC2.2 73.03,100.97 71.75,99.69 55.88,99.69 53.34,102.23 52.07,107.95 33.66,107.95 U$1.A5
  Bottom 0.61: RFC2.2 78.1,107.31 | FORCE2.SLEEVE 78.1,107.31 | 78.1,107.31 78.1,107.3 RFC2.2
FORCE3
  Top 0.61: U$1.D5 19.05,113.03 20.32,114.3 57.78,114.3 64.14,107.95 108.57,107.95 RFC3.2
  Bottom 0.61: FORCE3.SLEEVE 120.02,107.94 RFC3.2
FORCE4
  Top 0.61: RFC4.2 128.27,107.31 126.36,109.22 64.77,109.22 57.15,116.84 19.05,116.84 16.51,114.3 U$1.D6
  Bottom 0.61: FORCE4.SLEEVE 133.99,107.94 RFC4.2
GND  (1 unrouted)
  Top 0.61: JP19.3 45.4,20.64 46.36,19.68 | 46.36,19.68 71.12,19.68 | 71.12,19.68 JP11.3 | JP16.3 100.97,20.32 100.33,19.68 71.12,19.68 | JP3.3 19.05,19.68 46.36,19.68
  Bottom 0.61: 42.55,74.3 MWA1.2 | RFC1.1 56.5,102.22 53.34,99.06 | 53.34,99.06 50.8,96.52 | 50.8,96.52 42.55,74.3 | RFC2.1 70.48,97.16 69.85,96.52 | 69.85,96.52 50.8,96.52 | RFL1.1 83.82,98.42 81.91,96.52 | 81.91,96.52 70.48,96.52 | 70.48,96.52 69.85,96.52 | RFL2.1 97.79,98.42 95.88,96.52 | 95.88,96.52 81.91,96.52 | 111.12,96.52 111.76,97.16 RFC3.1 | 111.12,96.52 95.88,96.52 | 111.12,96.52 125.09,96.52 125.73,97.16 RFC4.1 | 32.39,121.28 29.21,118.11 U$1.GND1 29.21,106.05 34.29,100.97 34.29,99.06 | MWA0.2 14.61,71.75 17.14,74.3 | 17.14,74.3 42.55,74.3 | 70.48,74.93 70.48,96.52 | 3.81,82.55 8.89,82.55 17.14,74.3 | 34.29,99.06 U$1.GND 34.29,95.25 36.2,93.34 49.53,93.34 | 34.29,99.06 53.34,99.06 | 32.39,121.28 47.62,121.28 J1.39 | J1.25 32.39,121.28 | MWA3.2 98.42,73.03 95.88,75.56 71.12,75.56 70.48,74.93 | 70.48,74.93 MWA2.2
  Bottom 0.813: 3.81,82.55 3.79,82.57 GENERALPOWER.2
  pour Top (isolate 0.61): 24.77,19.88 24.64,73.03 4.95,73.03 5.08,19.88
  pour Bottom (isolate 0.61): 24.77,19.88 24.57,73.03 4.89,73.03 5.08,19.88
  pour Top (isolate 0.61): 52.7,19.88 52.58,73.03 32.89,73.03 33.02,19.88
  pour Bottom (isolate 0.61): 52.7,19.88 52.51,73.03 32.83,73.03 33.02,19.88
  pour Top (isolate 0.61): 80.64,19.88 80.52,73.03 60.83,73.03 60.96,19.88
  pour Bottom (isolate 0.406): 80.64,19.88 80.45,73.03 60.77,73.03 60.96,19.88
  pour Top (isolate 0.61): 108.58,19.88 108.46,73.03 88.77,73.03 88.9,19.88
  pour Bottom (isolate 0.61): 108.58,19.88 108.39,73.03 88.71,73.03 88.9,19.88
  pour Bottom (isolate 0.813): 141.6,130.18 -4.45,130.18 -6.98,127.64 -6.98,125.09 -6.98,20.95 1.27,12.7 135.89,12.7 137.16,13.97 137.16,15.24 137.16,92.71 142.24,97.79 142.24,101.6 142.24,130.18
  pour Top (isolate 1.016): 141.6,130.18 -4.45,130.18 -6.98,127.64 -6.98,125.09 -6.98,20.95 1.27,12.7 135.89,12.7 137.16,13.97 137.16,15.24 137.16,92.71 142.24,97.79 142.24,101.6 142.24,130.18
MISO
  Bottom 0.61: U$1.D12 10.79,121.28 25.4,121.28 27.3,123.19 J1.21
MM1
  Bottom 0.61: MW1.RING 122.58,17.12 109.85,29.84 54.61,29.84 25.4,56.52 MWC1.2
MM2
  Bottom 0.61: MW2.RING 122.58,33.63 120.02,36.2 72.39,36.2 56.52,52.07 56.52,55.24 55.25,56.52 MWC2.2
MM3
  Bottom 0.61: MW3.RING 117.45,50.14 113.03,45.72 95.88,45.72 85.09,56.52 MWC3.2
MM4
  Bottom 0.61: MW4.RING 121.27,66.66 111.12,56.52 MWC4.2
MOSI
  Top 0.61: J1.19 20.95,120.02 11.43,120.02 3.81,112.39 U$1.D11
N$1  (via drill 3.3)
  other vias: 8.45,24.13
N$2  (via drill 3.3)
  other vias: 21.4,68.58
N$8  (via drill 3.3)
  other vias: 36.39,24.13
N$9  (via drill 3.3)
  other vias: 49.34,68.58
N$12  (via drill 3.3)
  other vias: 64.33,24.13
N$13  (via drill 3.3)
  other vias: 77.28,68.58
N$16  (via drill 3.3)
  other vias: 92.27,24.13
N$17  (via drill 3.3)
  other vias: 105.22,68.58
RM1
  Bottom 0.61: MW1.SLEEVE 122.55,22.22 115.57,32.38 58.42,32.38 27.94,59.05 MWC1.3
RM2
  Bottom 0.61: MW2.SLEEVE 73.66,38.73 58.42,53.97 58.42,57.78 57.15,59.05 MWC2.3
RM3
  Bottom 0.61: MW3.SLEEVE 120.02,55.24 113.03,48.26 96.52,48.26 92.08,52.7 92.08,57.15 90.17,59.05 MWC3.3
RM4
  Bottom 0.61: MW4.SLEEVE 124.46,71.75 111.76,59.05 MWC4.3
SCK
  Bottom 0.61: J1.23 25.4,119.38 11.43,119.38 5.08,113.03 5.08,103.5 1.27,99.69 U$1.D13
SIG1
  Top 0.61: U$1.A0 8.89,92.71 17.14,84.45 MWA0.1
SIG2
  Top 0.61: U$1.A1 11.43,93.34 20.32,84.45 20.32,78.1 21.59,76.84 40,76.84 45.08,71.75 MWA1.3
SIG3
  Top 0.61: MWA2.3 65.41,78.74 24.13,78.74 24.13,84.45 13.97,94.61 U$1.A2
SIG4
  Top 0.61: U$1.A3 16.51,94.61 29.84,81.28 90.8,81.28 MWA3.3
SS
  Top 0.61: J1.24 29.84,127 31.11,128.27 52.07,128.27 52.7,127.64 52.7,121.92 52.07,121.28 24.77,121.28 22.23,118.75 12.06,118.75 6.35,113.03 U$1.D10

### Text on the board
Top: JOAKINATOR 1.1
Bottom: JOAKINATOR 1.1
tPlace: + | - | SIG | + | - | SIG | + | - | SIG | + | - | SIG | Proto | Shield | Proto | Shield | Proto | Shield | Proto | Shield